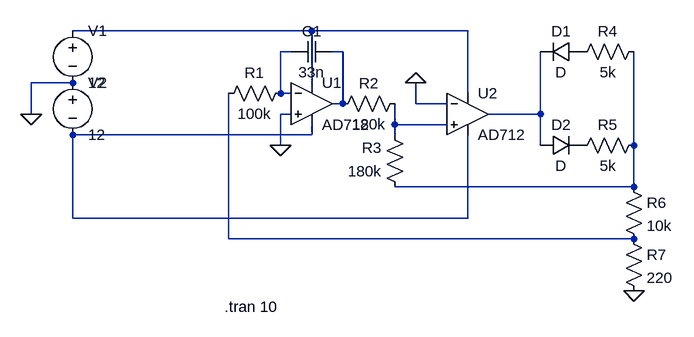
[diagram p0: schematic function generator.asc]
function generator.asc, the LTspice schematic file:
Version 4
SHEET 1 880 680
WIRE 48 -32 -320 -32
WIRE 288 -32 48 -32
WIRE 16 0 0 0
WIRE 96 0 80 0
WIRE -320 48 -384 48
WIRE 48 48 48 -32
WIRE 0 64 0 0
WIRE 16 64 0 64
WIRE 288 64 288 -32
WIRE 96 80 96 0
WIRE 96 80 80 80
WIRE 208 80 208 48
WIRE 256 80 208 80
WIRE -384 96 -384 48
WIRE 16 96 0 96
WIRE 400 96 400 0
WIRE 400 96 320 96
WIRE 176 112 176 80
WIRE 256 112 176 112
WIRE 48 128 48 112
WIRE 48 128 -320 128
WIRE 176 128 176 112
WIRE 0 144 0 96
WIRE 400 144 400 96
WIRE 544 144 544 0
WIRE 544 208 544 144
WIRE 544 208 176 208
WIRE -320 256 -320 128
WIRE 288 256 288 128
WIRE 288 256 -320 256
WIRE -80 288 -80 64
WIRE 544 288 -80 288
FLAG 544 368 0
FLAG 0 144 0
FLAG 208 48 0
FLAG -384 96 0
SYMBOL cap 80 -16 R90
WINDOW 0 0 32 VBottom 2
WINDOW 3 32 32 VTop 2
SYMATTR InstName C1
SYMATTR Value 33n
SYMBOL res 16 48 R90
WINDOW 0 0 56 VBottom 2
WINDOW 3 32 56 VTop 2
SYMATTR InstName R1
SYMATTR Value 100k
SYMBOL res 192 64 R90
WINDOW 0 0 56 VBottom 2
WINDOW 3 32 56 VTop 2
SYMATTR InstName R2
SYMATTR Value 180k
SYMBOL res 192 224 R180
WINDOW 0 36 76 Left 2
WINDOW 3 36 40 Left 2
SYMATTR InstName R3
SYMATTR Value 180k
SYMBOL diode 464 -16 R90
WINDOW 0 0 32 VBottom 2
WINDOW 3 32 32 VTop 2
SYMATTR InstName D1
SYMBOL diode 400 160 R270
WINDOW 0 32 32 VTop 2
WINDOW 3 0 32 VBottom 2
SYMATTR InstName D2
SYMBOL res 560 -16 R90
WINDOW 0 0 56 VBottom 2
WINDOW 3 32 56 VTop 2
SYMATTR InstName R4
SYMATTR Value 5k
SYMBOL res 560 128 R90
WINDOW 0 0 56 VBottom 2
WINDOW 3 32 56 VTop 2
SYMATTR InstName R5
SYMATTR Value 5k
SYMBOL res 528 192 R0
SYMATTR InstName R6
SYMATTR Value 10k
SYMBOL res 528 272 R0
SYMATTR InstName R7
SYMATTR Value 220
SYMBOL voltage -320 -48 R0
WINDOW 123 0 0 Left 0
WINDOW 39 0 0 Left 0
SYMATTR InstName V1
SYMATTR Value 12
SYMBOL voltage -320 32 R0
WINDOW 123 0 0 Left 0
WINDOW 39 0 0 Left 0
SYMATTR InstName V2
SYMATTR Value 12
SYMBOL OpAmps\\AD712 48 16 R0
SYMATTR InstName U1
SYMBOL OpAmps\\AD712 288 32 R0
SYMATTR InstName U2
TEXT -86 392 Left 2 !.tran 10

The netlist it stands for:
* function generator.asc
C1 N003 N002 33n
R1 N002 N008 100k
R2 N005 N003 180k
R3 N007 N005 180k
D1 P001 N004 D
D2 N004 P002 D
R4 N007 P001 5k
R5 N007 P002 5k
R6 N007 N008 10k
R7 N008 0 220
V1 N001 0 12
V2 0 N006 12
XU1 0 N002 N001 N006 N003 AD712  ; pins In+ In- V+ V- OUT
XU2 N005 0 N001 N006 N004 AD712  ; pins In+ In- V+ V- OUT
.model D D
.lib standard.dio
.tran 10
.backanno
.end